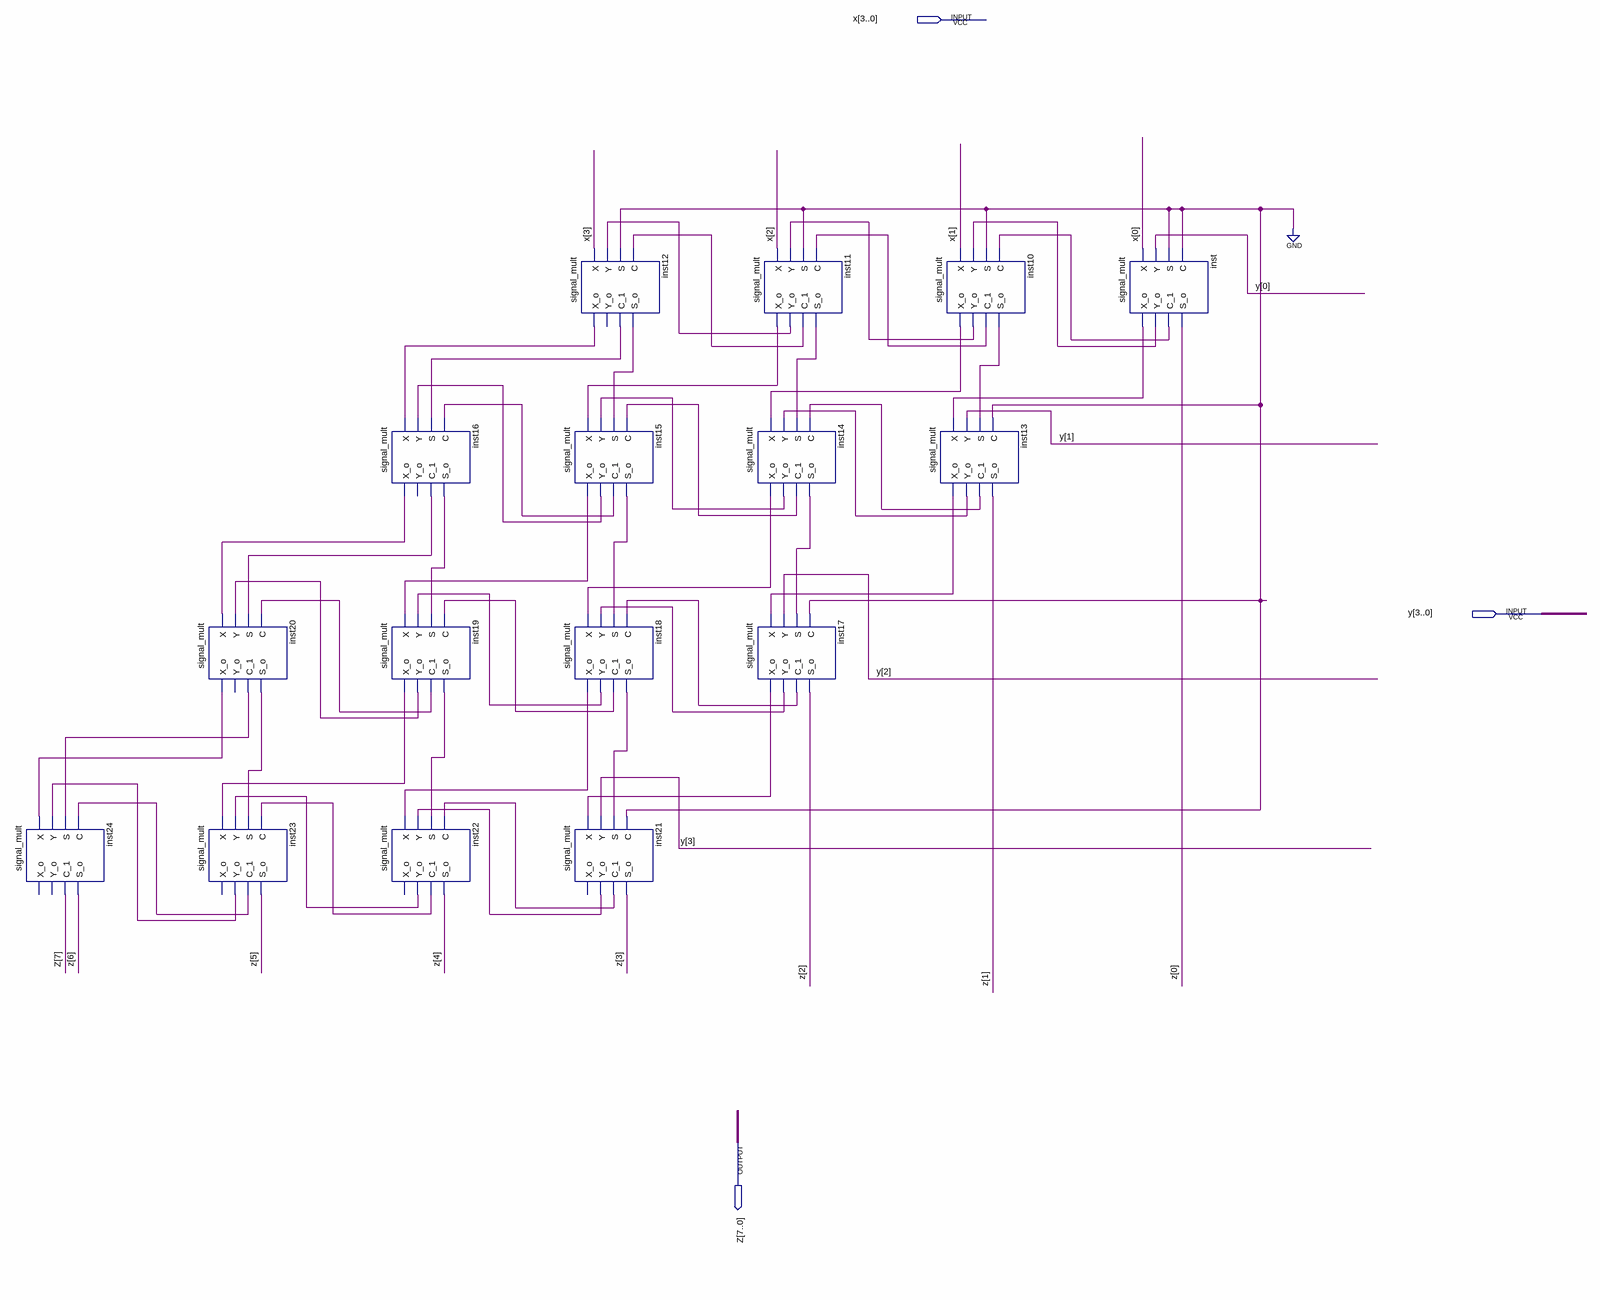
[diagram p0: schematic sheet]
// Quartus schematic mul4.bdf as structural Verilog: 16 symbols, 3 pins
module mul4 (
  input  [3:0] x,
  input  [3:0] y,
  output [7:0] Z
);

  wire inst10_c_1, inst10_s_o, inst10_x_o, inst10_y_o, inst11_c_1, inst11_s_o, inst11_x_o, inst11_y_o,
       inst12_c_1, inst12_s_o, inst12_x_o, inst13_c_1, inst13_x_o, inst13_y_o, inst14_c_1, inst14_s_o,
       inst14_x_o, inst14_y_o, inst15_c_1, inst15_s_o, inst15_x_o, inst15_y_o, inst16_c_1, inst16_s_o,
       inst16_x_o, inst17_c_1, inst17_x_o, inst17_y_o, inst18_c_1, inst18_s_o, inst18_x_o, inst18_y_o,
       inst19_c_1, inst19_s_o, inst19_x_o, inst19_y_o, inst20_c_1, inst20_s_o, inst20_x_o, inst21_c_1,
       inst21_y_o, inst22_c_1, inst22_y_o, inst23_c_1, inst23_y_o, inst_c_1, inst_x_o, inst_y_o;

  signal_mult inst24 (
    .X(inst20_x_o), .Y(inst23_y_o), .S(inst20_c_1), .C(inst23_c_1), .C_1(Z[7]), .S_o(Z[6]));  // open: X_o, Y_o
  signal_mult inst20 (
    .X(inst16_x_o), .Y(inst19_y_o), .S(inst16_c_1), .C(inst19_c_1), .X_o(inst20_x_o), .C_1(inst20_c_1),
    .S_o(inst20_s_o));  // open: Y_o
  signal_mult inst23 (
    .X(inst19_x_o), .Y(inst22_y_o), .S(inst20_s_o), .C(inst22_c_1), .Y_o(inst23_y_o), .C_1(inst23_c_1),
    .S_o(Z[5]));  // open: X_o
  signal_mult inst16 (
    .X(inst12_x_o), .Y(inst15_y_o), .S(inst12_c_1), .C(inst15_c_1), .X_o(inst16_x_o), .C_1(inst16_c_1),
    .S_o(inst16_s_o));  // open: Y_o
  signal_mult inst19 (
    .X(inst15_x_o), .Y(inst18_y_o), .S(inst16_s_o), .C(inst18_c_1), .X_o(inst19_x_o), .Y_o(inst19_y_o),
    .C_1(inst19_c_1), .S_o(inst19_s_o));
  signal_mult inst22 (
    .X(inst18_x_o), .Y(inst21_y_o), .S(inst19_s_o), .C(inst21_c_1), .Y_o(inst22_y_o), .C_1(inst22_c_1),
    .S_o(Z[4]));  // open: X_o
  signal_mult inst12 (
    .X(x[3]), .Y(inst11_y_o), .S(1'b0), .C(inst11_c_1), .X_o(inst12_x_o), .C_1(inst12_c_1), .S_o(inst12_s_o));  // open: Y_o
  signal_mult inst15 (
    .X(inst11_x_o), .Y(inst14_y_o), .S(inst12_s_o), .C(inst14_c_1), .X_o(inst15_x_o), .Y_o(inst15_y_o),
    .C_1(inst15_c_1), .S_o(inst15_s_o));
  signal_mult inst18 (
    .X(inst14_x_o), .Y(inst17_y_o), .S(inst15_s_o), .C(inst17_c_1), .X_o(inst18_x_o), .Y_o(inst18_y_o),
    .C_1(inst18_c_1), .S_o(inst18_s_o));
  signal_mult inst21 (
    .X(inst17_x_o), .Y(y[3]), .S(inst18_s_o), .C(1'b0), .Y_o(inst21_y_o), .C_1(inst21_c_1), .S_o(Z[3]));  // open: X_o
  signal_mult inst11 (
    .X(x[2]), .Y(inst10_y_o), .S(1'b0), .C(inst10_c_1), .X_o(inst11_x_o), .Y_o(inst11_y_o), .C_1(inst11_c_1),
    .S_o(inst11_s_o));
  signal_mult inst14 (
    .X(inst10_x_o), .Y(inst13_y_o), .S(inst11_s_o), .C(inst13_c_1), .X_o(inst14_x_o), .Y_o(inst14_y_o),
    .C_1(inst14_c_1), .S_o(inst14_s_o));
  signal_mult inst17 (
    .X(inst13_x_o), .Y(y[2]), .S(inst14_s_o), .C(1'b0), .X_o(inst17_x_o), .Y_o(inst17_y_o), .C_1(inst17_c_1),
    .S_o(Z[2]));
  signal_mult inst10 (
    .X(x[1]), .Y(inst_y_o), .S(1'b0), .C(inst_c_1), .X_o(inst10_x_o), .Y_o(inst10_y_o), .C_1(inst10_c_1),
    .S_o(inst10_s_o));
  signal_mult inst13 (
    .X(inst_x_o), .Y(y[1]), .S(inst10_s_o), .C(1'b0), .X_o(inst13_x_o), .Y_o(inst13_y_o), .C_1(inst13_c_1),
    .S_o(Z[1]));
  signal_mult inst (.X(x[0]), .Y(y[0]), .S(1'b0), .C(1'b0), .X_o(inst_x_o), .Y_o(inst_y_o), .C_1(inst_c_1), .S_o(Z[0]));
endmodule
